# EAGLE design Business_Card_without_led (EAGLE 9.5.2)
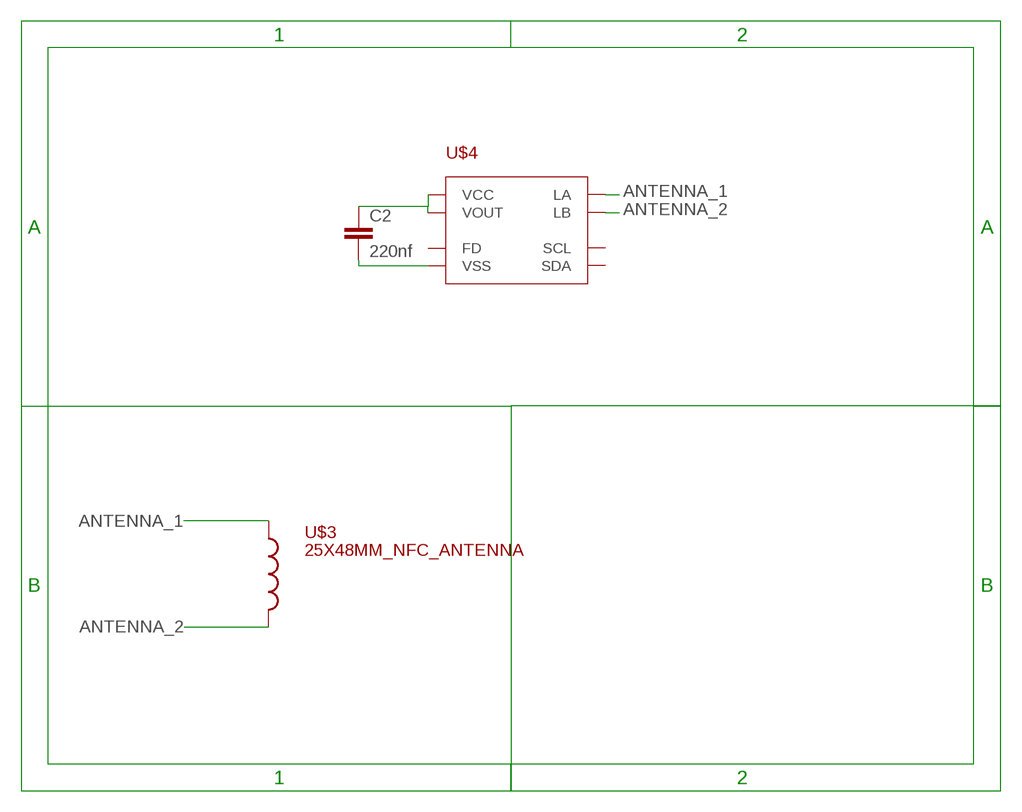
[diagram p0: schematic, sheet 1]

## Parts
C2  220nf  C-EUC0603  [C0603]
U$3  25X48MM_NFC_ANTENNA  [25X48MM_NFC_ANTENNA]
U$4  NT3H  [XQFN8]

## Nets
ANTENNA_1: U$3.P$1 U$4.LA
ANTENNA_2: U$3.P$2 U$4.LB
N$1: C2.1 U$4.VCC U$4.VOUT
N$2: C2.2 U$4.VSS
Unconnected: U$4.FD U$4.SCL U$4.SDA

## Library data of the parts
C2 = rcl:C-EU: CAPACITOR, European symbol; SPICEPREFIX: C
U$3 = PCB_BusinessCard:25X48MM_NFC_ANTENNA: 25x48 mm NFC loop antenna, L = 2,75 µH
U$4 = PCB_BusinessCard:NT3H: NXP NTAG NT3H

## Board
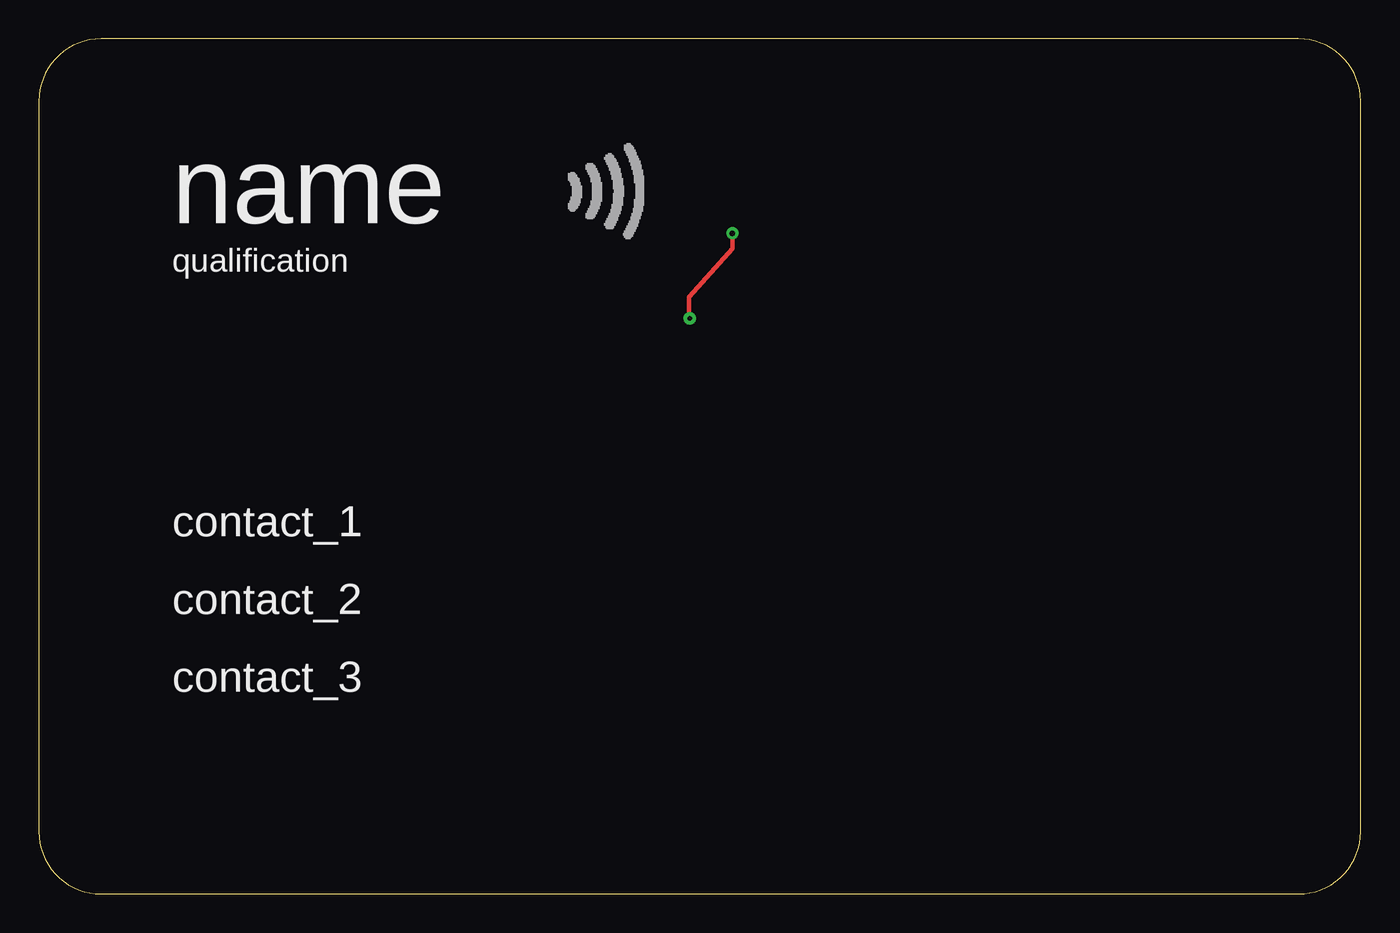
[diagram p1: board, top side]
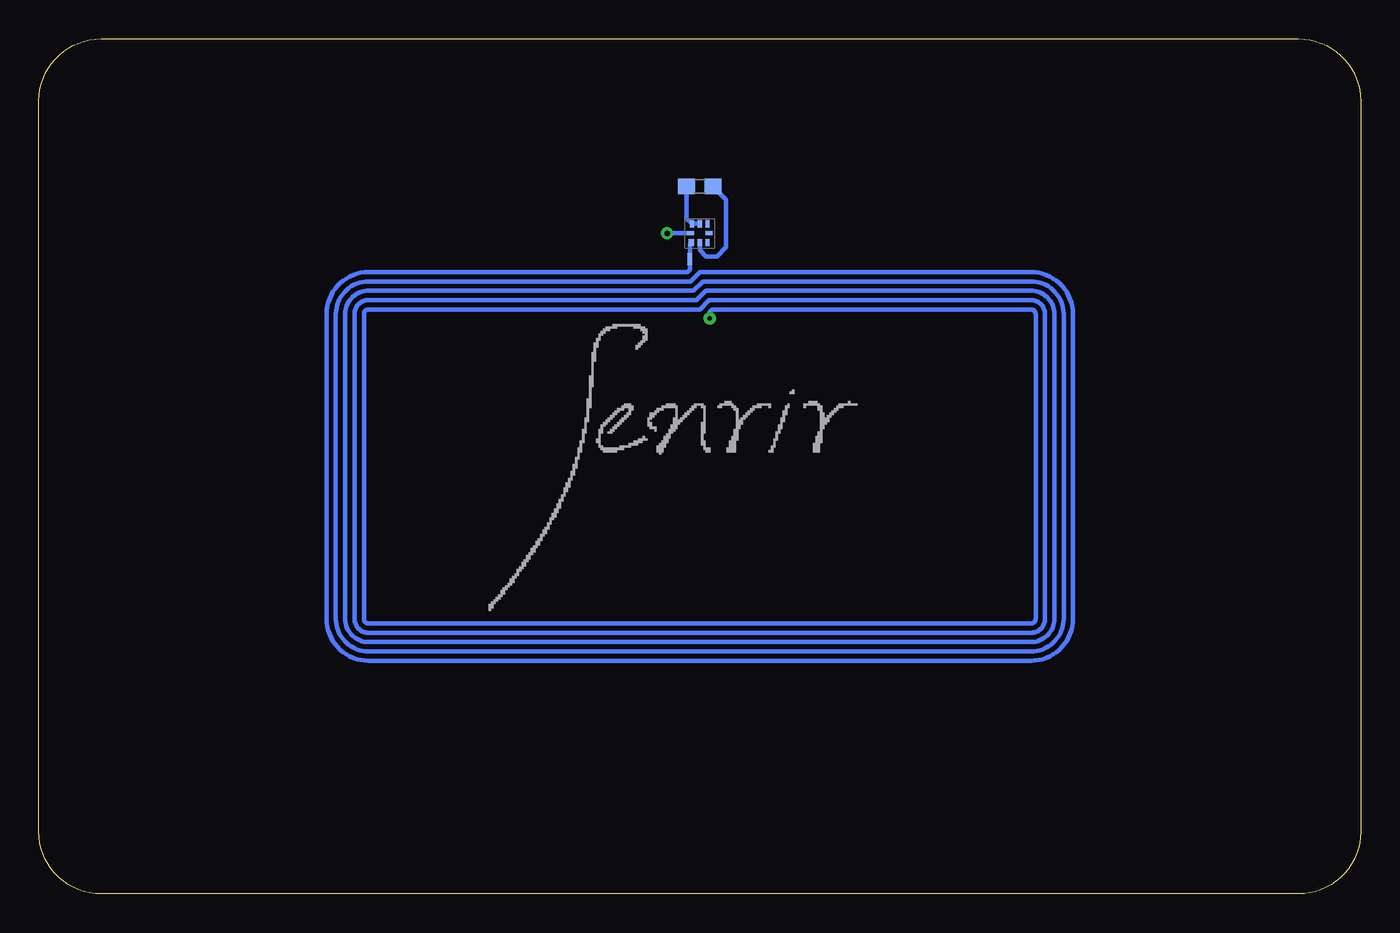
[diagram p2: board, bottom side, seen from below]

Size 85 x 55 mm. Coordinates in mm from the lower left corner, seen from the top.
Outline: 0,51 0,4 arc90 4,0 81,0 arc90 85,4 85,51 arc90 81,55 4,55 arc90 0,51
Copper layers (1*16): Top 0.035mm / dielectric 1.5mm / Bottom 0.035mm
Design rules "default": minimum track width 6mil, minimum drill 0.35mm, track to track 6mil, track to pad 6mil, pad to pad 6mil, via to via 6mil, smd to smd 6mil, copper to edge 40mil, drill to drill 6mil, minimum pad ring 10mil, minimum via ring 8mil, stop-mask expansion 4mil, vias tented up to drill 0mil, thermal gap 10mil

### Footprints (pad centres in the part's own frame; a part is rotated, then mirrored left to right if it is on the bottom)
C0603 = smd 1.1 x 1: 1 -0.85,0; 2 0.85,0
25X48MM_NFC_ANTENNA = smd 0.3 x 0.75: P$1 -0.635,13.335 | drill 0.3: P$2 0.635,9.525
XQFN8 = smd 0.27 x 0.45: FD 0,-0.6; LB 0,0.6 | smd 0.45 x 0.37: LA -0.6,0.55 | smd 0.45 x 0.27: SCL -0.6,-0.5; SDA 0.6,-0.5; VCC 0.6,0; VOUT 0.6,0.5; VSS -0.6,0

### Placement (x,y rotation side)
C2  42.5,45.5 0 bottom
U$3  42.5,27.5 0 bottom
U$4  42.5,42.5 90 bottom

### Tracks (layer width: path | path; a pad name or v marks a point on that pad's centre or on a via)
ANTENNA_1
  Bottom 0.3: U$4.LA 43.13,41.81 U$3.P$1
ANTENNA_2  (via drill 0.35)
  Top 0.3: U$3.P$2 41.8,37.4 41.8,38.4 44.6,41.5 v44.6,42.5
  Bottom 0.3: U$4.LB v44.6,42.5
N$1
  Bottom 0.3: C2.1 43.35,43.45 U$4.VOUT U$4.VCC
N$2
  Bottom 0.3: U$4.VSS 42.5,41.4 42.1,41 41.4,41 40.8,41.6 40.8,44.65 C2.2

### Text on the board
tPlace: name | qualification | contact_1 | contact_2 | contact_3